# Altium schematic sheet Current Sinks.SchDoc
size A4
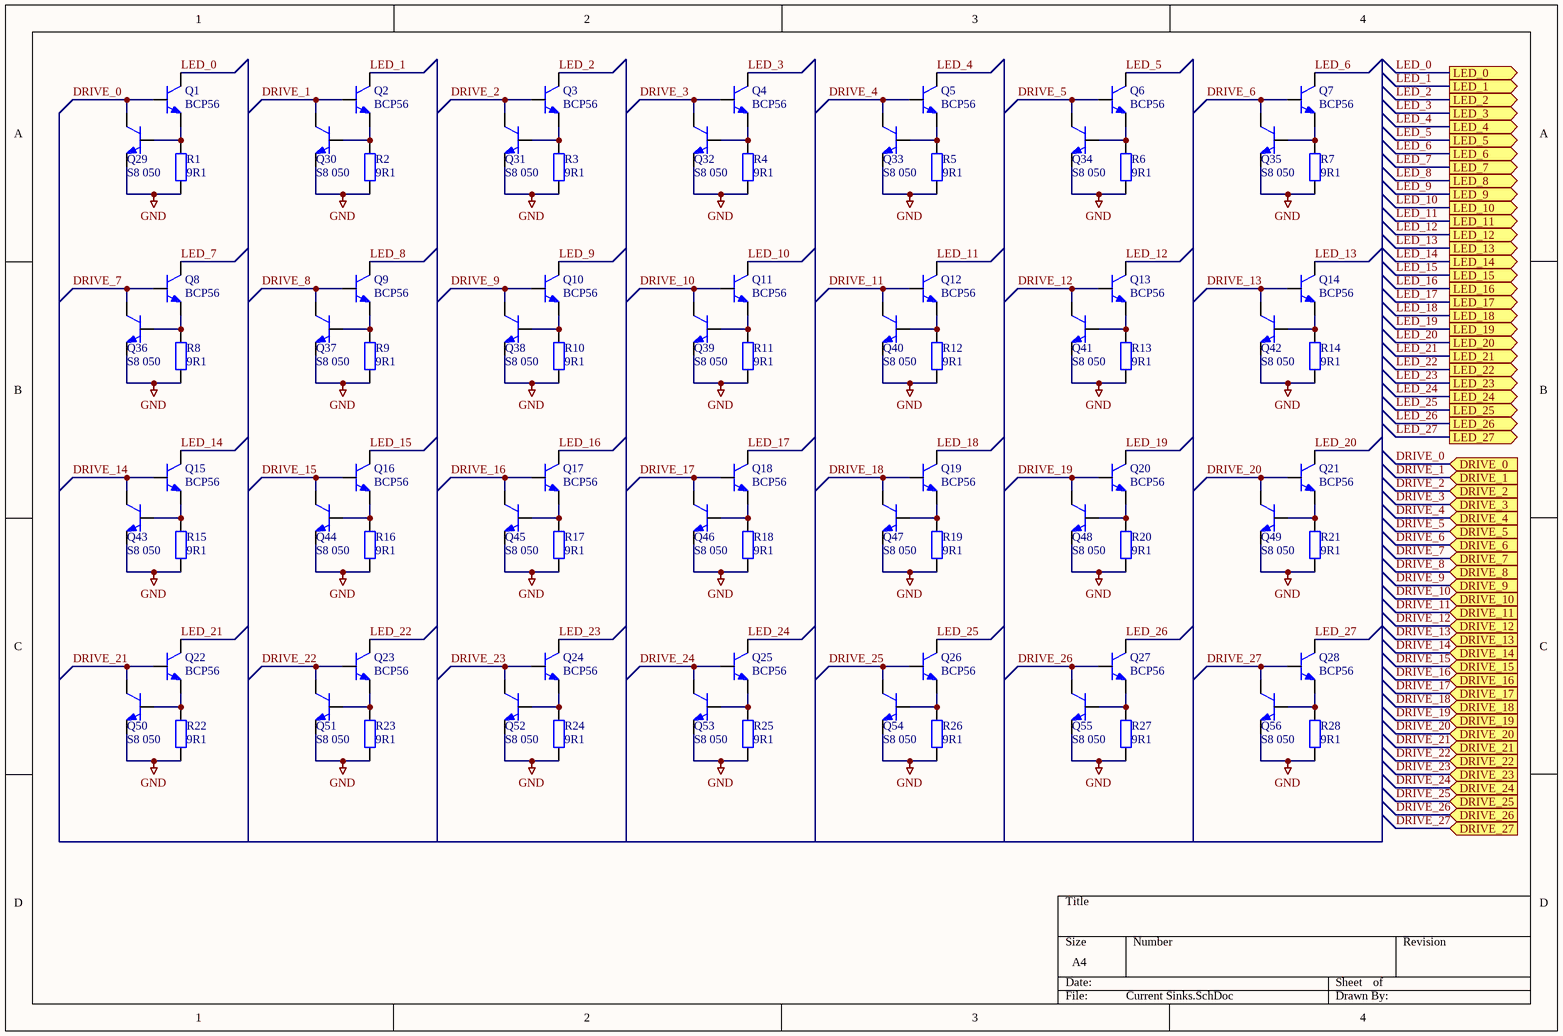
[diagram p0: Current Sinks.SchDoc]

## Parts
Q1  BCP56  [SOT223]
Q2  BCP56  [SOT223]
Q3  BCP56  [SOT223]
Q4  BCP56  [SOT223]
Q5  BCP56  [SOT223]
Q6  BCP56  [SOT223]
Q7  BCP56  [SOT223]
Q8  BCP56  [SOT223]
Q9  BCP56  [SOT223]
Q10  BCP56  [SOT223]
Q11  BCP56  [SOT223]
Q12  BCP56  [SOT223]
Q13  BCP56  [SOT223]
Q14  BCP56  [SOT223]
Q15  BCP56  [SOT223]
Q16  BCP56  [SOT223]
Q17  BCP56  [SOT223]
Q18  BCP56  [SOT223]
Q19  BCP56  [SOT223]
Q20  BCP56  [SOT223]
Q21  BCP56  [SOT223]
Q22  BCP56  [SOT223]
Q23  BCP56  [SOT223]
Q24  BCP56  [SOT223]
Q25  BCP56  [SOT223]
Q26  BCP56  [SOT223]
Q27  BCP56  [SOT223]
Q28  BCP56  [SOT223]
Q29  S8 050  [SOT23-3L]
Q30  S8 050  [SOT23-3L]
Q31  S8 050  [SOT23-3L]
Q32  S8 050  [SOT23-3L]
Q33  S8 050  [SOT23-3L]
Q34  S8 050  [SOT23-3L]
Q35  S8 050  [SOT23-3L]
Q36  S8 050  [SOT23-3L]
Q37  S8 050  [SOT23-3L]
Q38  S8 050  [SOT23-3L]
Q39  S8 050  [SOT23-3L]
Q40  S8 050  [SOT23-3L]
Q41  S8 050  [SOT23-3L]
Q42  S8 050  [SOT23-3L]
Q43  S8 050  [SOT23-3L]
Q44  S8 050  [SOT23-3L]
Q45  S8 050  [SOT23-3L]
Q46  S8 050  [SOT23-3L]
Q47  S8 050  [SOT23-3L]
Q48  S8 050  [SOT23-3L]
Q49  S8 050  [SOT23-3L]
Q50  S8 050  [SOT23-3L]
Q51  S8 050  [SOT23-3L]
Q52  S8 050  [SOT23-3L]
Q53  S8 050  [SOT23-3L]
Q54  S8 050  [SOT23-3L]
Q55  S8 050  [SOT23-3L]
Q56  S8 050  [SOT23-3L]
R1  9R1  [RESISTOR 0805]
R2  9R1  [RESISTOR 0805]
R3  9R1  [RESISTOR 0805]
R4  9R1  [RESISTOR 0805]
R5  9R1  [RESISTOR 0805]
R6  9R1  [RESISTOR 0805]
R7  9R1  [RESISTOR 0805]
R8  9R1  [RESISTOR 0805]
R9  9R1  [RESISTOR 0805]
R10  9R1  [RESISTOR 0805]
R11  9R1  [RESISTOR 0805]
R12  9R1  [RESISTOR 0805]
R13  9R1  [RESISTOR 0805]
R14  9R1  [RESISTOR 0805]
R15  9R1  [RESISTOR 0805]
R16  9R1  [RESISTOR 0805]
R17  9R1  [RESISTOR 0805]
R18  9R1  [RESISTOR 0805]
R19  9R1  [RESISTOR 0805]
R20  9R1  [RESISTOR 0805]
R21  9R1  [RESISTOR 0805]
R22  9R1  [RESISTOR 0805]
R23  9R1  [RESISTOR 0805]
R24  9R1  [RESISTOR 0805]
R25  9R1  [RESISTOR 0805]
R26  9R1  [RESISTOR 0805]
R27  9R1  [RESISTOR 0805]
R28  9R1  [RESISTOR 0805]

## Ports
DRIVE_0 (in), DRIVE_1 (in), DRIVE_2 (in), DRIVE_3 (in), DRIVE_4 (in), DRIVE_5 (in), DRIVE_6 (in), DRIVE_7 (in), DRIVE_8 (in), DRIVE_9 (in), DRIVE_10 (in), DRIVE_11 (in), DRIVE_12 (in), DRIVE_13 (in), DRIVE_14 (in), DRIVE_15 (in), DRIVE_16 (in), DRIVE_17 (in), DRIVE_18 (in), DRIVE_19 (in), DRIVE_20 (in), DRIVE_21 (in), DRIVE_22 (in), DRIVE_23 (in), DRIVE_24 (in), DRIVE_25 (in), DRIVE_26 (in), DRIVE_27 (in), LED_0 (out), LED_1 (out), LED_2 (out), LED_3 (out), LED_4 (out), LED_5 (out), LED_6 (out), LED_7 (out), LED_8 (out), LED_9 (out), LED_10 (out), LED_11 (out), LED_12 (out), LED_13 (out), LED_14 (out), LED_15 (out), LED_16 (out), LED_17 (out), LED_18 (out), LED_19 (out), LED_20 (out), LED_21 (out), LED_22 (out), LED_23 (out), LED_24 (out), LED_25 (out), LED_26 (out), LED_27 (out)

## Nets
GND: Q29.3(E) Q30.3(E) Q31.3(E) Q32.3(E) Q33.3(E) Q34.3(E) Q35.3(E) Q36.3(E) Q37.3(E) Q38.3(E) Q39.3(E) Q40.3(E) Q41.3(E) Q42.3(E) Q43.3(E) Q44.3(E) Q45.3(E) Q46.3(E) Q47.3(E) Q48.3(E) Q49.3(E) Q50.3(E) Q51.3(E) Q52.3(E) Q53.3(E) Q54.3(E) Q55.3(E) Q56.3(E) R1.1 R2.1 R3.1 R4.1 R5.1 R6.1 R7.1 R8.1 R9.1 R10.1 R11.1 R12.1 R13.1 R14.1 R15.1 R16.1 R17.1 R18.1 R19.1 R20.1 R21.1 R22.1 R23.1 R24.1 R25.1 R26.1 R27.1 R28.1
DRIVE_0: Q1.1(B) Q29.2(C) ; port DRIVE_0
DRIVE_1: Q2.1(B) Q30.2(C) ; port DRIVE_1
DRIVE_2: Q3.1(B) Q31.2(C) ; port DRIVE_2
DRIVE_3: Q4.1(B) Q32.2(C) ; port DRIVE_3
DRIVE_4: Q5.1(B) Q33.2(C) ; port DRIVE_4
DRIVE_5: Q6.1(B) Q34.2(C) ; port DRIVE_5
DRIVE_6: Q7.1(B) Q35.2(C) ; port DRIVE_6
DRIVE_7: Q8.1(B) Q36.2(C) ; port DRIVE_7
DRIVE_8: Q9.1(B) Q37.2(C) ; port DRIVE_8
DRIVE_9: Q10.1(B) Q38.2(C) ; port DRIVE_9
DRIVE_10: Q11.1(B) Q39.2(C) ; port DRIVE_10
DRIVE_11: Q12.1(B) Q40.2(C) ; port DRIVE_11
DRIVE_12: Q13.1(B) Q41.2(C) ; port DRIVE_12
DRIVE_13: Q14.1(B) Q42.2(C) ; port DRIVE_13
DRIVE_14: Q15.1(B) Q43.2(C) ; port DRIVE_14
DRIVE_15: Q16.1(B) Q44.2(C) ; port DRIVE_15
DRIVE_16: Q17.1(B) Q45.2(C) ; port DRIVE_16
DRIVE_17: Q18.1(B) Q46.2(C) ; port DRIVE_17
DRIVE_18: Q19.1(B) Q47.2(C) ; port DRIVE_18
DRIVE_19: Q20.1(B) Q48.2(C) ; port DRIVE_19
DRIVE_20: Q21.1(B) Q49.2(C) ; port DRIVE_20
DRIVE_21: Q22.1(B) Q50.2(C) ; port DRIVE_21
DRIVE_22: Q23.1(B) Q51.2(C) ; port DRIVE_22
DRIVE_23: Q24.1(B) Q52.2(C) ; port DRIVE_23
DRIVE_24: Q25.1(B) Q53.2(C) ; port DRIVE_24
DRIVE_25: Q26.1(B) Q54.2(C) ; port DRIVE_25
DRIVE_26: Q27.1(B) Q55.2(C) ; port DRIVE_26
DRIVE_27: Q28.1(B) Q56.2(C) ; port DRIVE_27
LED_0: Q1.2(C) ; port LED_0
LED_1: Q2.2(C) ; port LED_1
LED_2: Q3.2(C) ; port LED_2
LED_3: Q4.2(C) ; port LED_3
LED_4: Q5.2(C) ; port LED_4
LED_5: Q6.2(C) ; port LED_5
LED_6: Q7.2(C) ; port LED_6
LED_7: Q8.2(C) ; port LED_7
LED_8: Q9.2(C) ; port LED_8
LED_9: Q10.2(C) ; port LED_9
LED_10: Q11.2(C) ; port LED_10
LED_11: Q12.2(C) ; port LED_11
LED_12: Q13.2(C) ; port LED_12
LED_13: Q14.2(C) ; port LED_13
LED_14: Q15.2(C) ; port LED_14
LED_15: Q16.2(C) ; port LED_15
LED_16: Q17.2(C) ; port LED_16
LED_17: Q18.2(C) ; port LED_17
LED_18: Q19.2(C) ; port LED_18
LED_19: Q20.2(C) ; port LED_19
LED_20: Q21.2(C) ; port LED_20
LED_21: Q22.2(C) ; port LED_21
LED_22: Q23.2(C) ; port LED_22
LED_23: Q24.2(C) ; port LED_23
LED_24: Q25.2(C) ; port LED_24
LED_25: Q26.2(C) ; port LED_25
LED_26: Q27.2(C) ; port LED_26
LED_27: Q28.2(C) ; port LED_27
NetQ1_3: Q1.3(E) Q29.1(B) R1.2
NetQ2_3: Q2.3(E) Q30.1(B) R2.2
NetQ3_3: Q3.3(E) Q31.1(B) R3.2
NetQ4_3: Q4.3(E) Q32.1(B) R4.2
NetQ5_3: Q5.3(E) Q33.1(B) R5.2
NetQ6_3: Q6.3(E) Q34.1(B) R6.2
NetQ7_3: Q7.3(E) Q35.1(B) R7.2
NetQ8_3: Q8.3(E) Q36.1(B) R8.2
NetQ9_3: Q9.3(E) Q37.1(B) R9.2
NetQ10_3: Q10.3(E) Q38.1(B) R10.2
NetQ11_3: Q11.3(E) Q39.1(B) R11.2
NetQ12_3: Q12.3(E) Q40.1(B) R12.2
NetQ13_3: Q13.3(E) Q41.1(B) R13.2
NetQ14_3: Q14.3(E) Q42.1(B) R14.2
NetQ15_3: Q15.3(E) Q43.1(B) R15.2
NetQ16_3: Q16.3(E) Q44.1(B) R16.2
NetQ17_3: Q17.3(E) Q45.1(B) R17.2
NetQ18_3: Q18.3(E) Q46.1(B) R18.2
NetQ19_3: Q19.3(E) Q47.1(B) R19.2
NetQ20_3: Q20.3(E) Q48.1(B) R20.2
NetQ21_3: Q21.3(E) Q49.1(B) R21.2
NetQ22_3: Q22.3(E) Q50.1(B) R22.2
NetQ23_3: Q23.3(E) Q51.1(B) R23.2
NetQ24_3: Q24.3(E) Q52.1(B) R24.2
NetQ25_3: Q25.3(E) Q53.1(B) R25.2
NetQ26_3: Q26.3(E) Q54.1(B) R26.2
NetQ27_3: Q27.3(E) Q55.1(B) R27.2
NetQ28_3: Q28.3(E) Q56.1(B) R28.2

## Library data of the parts
Q1-Q56 = NPN: BCP56 80 V, 1 A NPN medium power transistors
R1-R28 = Res2: Resistor; Published: 8-Jun-2000; LatestRevisionDate: 17-Jul-2002; LatestRevisionNote: Re-released for DXP Platform.; PackageReference: AXIAL-0.4; Publisher: Altium Limited; PackageDescription: Axial Device, Thru-Hole; 2 Leads; 0.4 in Pin Spacing; Value: 9R1